# Altium schematic sheet Pico_Stringer_Sch.Schdoc
size A4
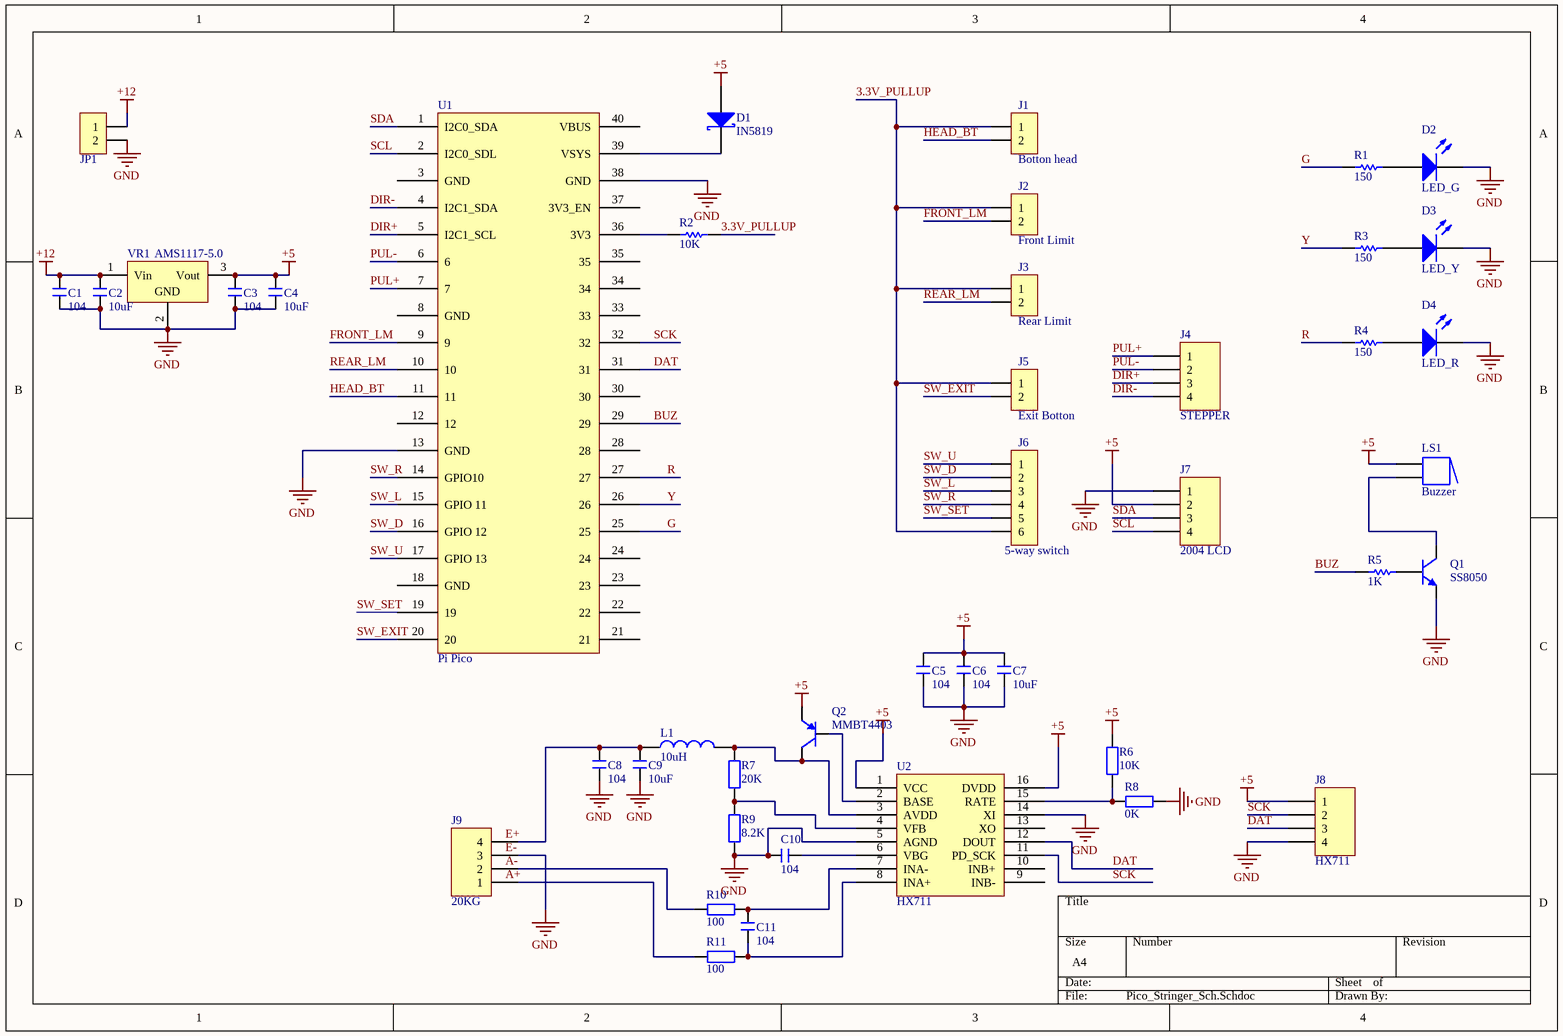
[diagram p0: Pico_Stringer_Sch.Schdoc]

## Parts
C1  104  [6-0805_M]
C2  10uF  [C1210_M]
C3  104  [6-0805_M]
C4  10uF  [C1210_M]
C5  104  [6-0805_M]
C6  104  [6-0805_M]
C7  10uF  [C1210_M]
C8  104  [6-0805_M]
C9  10uF  [C1210_M]
C10  104  [6-0805_M]
C11  104  [6-0805_M]
D1  IN5819  [DO-41]
D2  LED_G  [10mm LED]
D3  LED_Y  [10mm LED]
D4  LED_R  [10mm LED]
J1  Botton head  [XH2.54-LI-2P]
J2  Front Limit  [XH2.54-LI-2P]
J3  Rear Limit  [XH2.54-LI-2P]
J4  STEPPER  [XH2.54-LI-4P]
J5  Exit Botton  [12x12mm SWITCH]
J6  5-way switch  [5WAY_SWITCH]
J7  2004 LCD  [HDR1X4]
J8  HX711  [HX711_MODULE]
J9  20KG  [HDR1X4]
JP1  HDR-1X2  [XH2.54-LI-2P]  (value not drawn)
L1  10uH  [L 1210]
LS1  Buzzer  [Buzzer]
Q1  SS8050  [TO92A]
Q2  MMBT4403  [SOT23-3L]
R1  150  [AXIAL-0.3]
R2  10K  [AXIAL-0.3]
R3  150  [AXIAL-0.3]
R4  150  [AXIAL-0.3]
R5  1K  [AXIAL-0.3]
R6  10K  [6-0805_N]
R7  20K  [6-0805_M]
R8  0K  [6-0805_M]
R9  8.2K  [6-0805_M]
R10  100  [6-0805_M]
R11  100  [6-0805_M]
U1  Pi Pico  [PICO]
U2  HX711  [SOP16]
VR1  AMS1117-5.0  [AMS1117]

## Nets
+5: C3.2 C4.2 C5.2 C6.2 C7.2 D1.1(A) J7.2 J8.1 LS1.1 Q2.2(E) R6.2 U2.1(VCC) U2.16(DVDD) VR1.3(Vout)
+12: C1.2 C2.2 JP1.1 VR1.1(Vin)
GND: C1.1 C2.1 C3.1 C4.1 C5.1 C6.1 C7.1 C8.1 C9.1 C10.2 D2.2(K) D3.2(K) D4.2(K) J7.1 J8.4 J9.3 JP1.2 Q1.1(E) R8.1 R9.1 U1.13(GND) U1.38(GND) U2.5(AGND) U2.14(XI) VR1.2(GND)
3.3V_PULLUP: J1.1 J2.1 J3.1 J5.1 J6.6 R2.2
BUZ: R5.1 U1.29
DAT: J8.3 U1.31 U2.12(DOUT)
DIR+: J4.3 U1.5(I2C1_SCL)
DIR-: J4.4 U1.4(I2C1_SDA)
FRONT_LM: J2.2 U1.9
G: R1.1 U1.25
HEAD_BT: J1.2 U1.11
PUL+: J4.1 U1.7
PUL-: J4.2 U1.6
R: R4.1 U1.27
REAR_LM: J3.2 U1.10
SCK: J8.2 U1.32 U2.11(PD_SCK)
SCL: J7.4 U1.2(I2C0_SDL)
SDA: J7.3 U1.1(I2C0_SDA)
SW_D: J6.2 U1.16(GPIO_12)
SW_EXIT: J5.2 U1.20
SW_L: J6.3 U1.15(GPIO_11)
SW_R: J6.4 U1.14(GPIO10)
SW_SET: J6.5 U1.19
SW_U: J6.1 U1.17(GPIO_13)
Y: R3.1 U1.26
NetC8_2: C8.2 C9.2 J9.4 L1.1
NetC10_1: C10.1 U2.6(VBG)
NetC11_1: C11.1 R11.2 U2.8(INA+)
NetC11_2: C11.2 R10.2 U2.7(INA-)
NetD1_2: D1.2(K) U1.39(VSYS)
NetD2_1: D2.1(A) R1.2
NetD3_1: D3.1(A) R3.2
NetD4_1: D4.1(A) R4.2
NetJ9_1: J9.1 R11.1
NetJ9_2: J9.2 R10.1
NetL1_2: L1.2 Q2.3(C) R7.2 U2.3(AVDD)
NetLS1_2: LS1.2 Q1.3(C)
NetQ1_2: Q1.2(B) R5.2
NetQ2_1: Q2.1(B) U2.2(BASE)
NetR2_1: R2.1 U1.36(3V3)
NetR6_1: R6.1 R8.2 U2.15(RATE)
NetR7_1: R7.1 R9.2 U2.4(VFB)

Not connected (* = marked no-connect by the designer): U1 3(GND) 8(GND) 12 18(GND) 21 22 23 24 28 30 33 34 35 37(3V3_EN) 40(VBUS); U2 9(INB-) 10(INB+) 13(XO)

## Notes on the sheet
- Labels drawn without touching a wire or pin: A+, A-, E+, E-

## Library data of the parts
C1-C11 = C: 贴片电容; BOM名称: 无极性贴片电容; 淘宝ID: 封装库来自淘宝 ID：黄晶宝石; 联系售后，技术支持: https://shop463601444.taobao.com; 唯一出售店铺网址: https://shop463601444.taobao.com
D1 = D Schottky: Schottky Diode; Published: 8-Jun-2000; LatestRevisionDate: 17-Jul-2002; LatestRevisionNote: Re-released for DXP Platform.; PackageReference: SMB; Publisher: Altium Limited; PackageDescription: DO-214-AA/SMB; 2 C-Bend Leads; Body 5.3 x 3.6 mm, inc. leads (LxW); Code_JEDEC: DO-214-AA
D2-D4 = LED2: Typical RED, GREEN, YELLOW, AMBER GaAs LED; Published: 8-Jun-2000; LatestRevisionDate: 17-Jul-2002; LatestRevisionNote: Re-released for DXP Platform.; PackageVersion: Feb-2002; PackageReference: 3.2X1.6X1.1; Publisher: Altium Limited; PackageDescription: SM LED; 2 Flat Leads
J1-J3 J5 = Header 2: 2P接插件; 版权归属: 封装库来自淘宝 ID：黄晶宝石; BOM名称: 2P接插件; 联系售后: https://shop463601444.taobao.com
J4 = Header 4: DIR PUL; LatestRevisionDate: 17-Jul-2002; LatestRevisionNote: Re-released for DXP Platform.; Publisher: Altium Limited
J6 = Header 6: 6P接插件; 版权归属: 封装库来自淘宝 ID：黄晶宝石; BOM名称: 6P接插件; 学习资源: https://shop463601444.taobao.com
J7 = Header 4: 2004 I2C LCD; LatestRevisionDate: 17-Jul-2002; LatestRevisionNote: Re-released for DXP Platform.; Publisher: Altium Limited
J8 = Header 4: HX711 module; LatestRevisionDate: 17-Jul-2002; LatestRevisionNote: Re-released for DXP Platform.; Publisher: Altium Limited
J9 = Header 4: Keyes Hx711 module; LatestRevisionDate: 17-Jul-2002; LatestRevisionNote: Re-released for DXP Platform.; Publisher: Altium Limited
JP1 = Header 2: 5V; BOM名称: 2P接插件; 版权归属: 封装库来自淘宝 ID：黄晶宝石; 联系售后: https://shop463601444.taobao.com
L1 = L: 小功率贴片电感; 淘宝ID: 封装库来自淘宝 ID：黄晶宝石; 封装库来自淘宝卖家 ID：黄晶宝石: 其他店铺购入均为盗版，不享受售后技术支持服务，请立即申请退款; BOM名称: 小功率贴片电感; 联系售后: https://shop463601444.taobao.com
LS1 = Buzzer: Magnetic Transducer Buzzer; Published: 24-Mar-1999; LatestRevisionDate: 17-Dec-2003; LatestRevisionNote: Schematic revised, PCB Footprint replaced.; DatasheetVersion: 17-Dec-2003; PackageReference: ABSM-1574; Publisher: Altium Limited; PackageDescription: Magnetic Transducer Buzzer; ComponentLink1Description: Manufacturer Link; ComponentLink1URL: http://www.megastar.com/linecard/buzzmode/index.php
Q1 = 8050-DIP: 高频放大-NPN型; 版权归属: 封装库来自淘宝 ID：黄晶宝石; 属性: 40V 1.5A 1W 100MHZ; BOM名称: 高频放大-NPN型; 技术支持，联系售后: https://shop463601444.taobao.com
Q2 = 8550-SMD: 高频放大-PNP型; 版权归属: 封装库来自淘宝 ID：黄晶宝石; 属性: 40V 1.5A 1W 100MHZ; BOM名称: 高频放大-PNP型; 学习资源: www.ooocke.com
R1-R5 = Res1: Resistor; Published: 8-Jun-2000; LatestRevisionDate: 17-Jul-2002; LatestRevisionNote: Re-released for DXP Platform.; PackageReference: AXIAL-0.3; Publisher: Altium Limited; PackageDescription: Axial Device, Thru-Hole; 2 Leads; 0.3 in Pin Spacing
  R1 R3 R4: Value: 150
  R2: Value: 10K
  R5: Value: 1K
R6-R11 = R: 贴片电阻; 版权归属: 来自淘宝 ID：黄晶宝石; 封装库来自淘宝卖家 ID：黄晶宝石: 其他店铺购入均为盗版，不享受售后技术支持服务，请立即申请退款; BOM名称: 贴片电阻; 联系售后: https://shop463601444.taobao.com
VR1 = Volt Reg: Voltage Regulator; Published: 24-Mar-1999; LatestRevisionDate: 29-May-2009; LatestRevisionNote: IPC-7351 Footprint Added.; PackageReference: D2PAK; Publisher: Altium Limited; PackageDescription: 3-Pin Transistor Outline Package 2.54 mm Pitch, 15.1 mm Lead Span